# Altium project 175-00029, rev4, 486 CCD Interface.PrjPcb
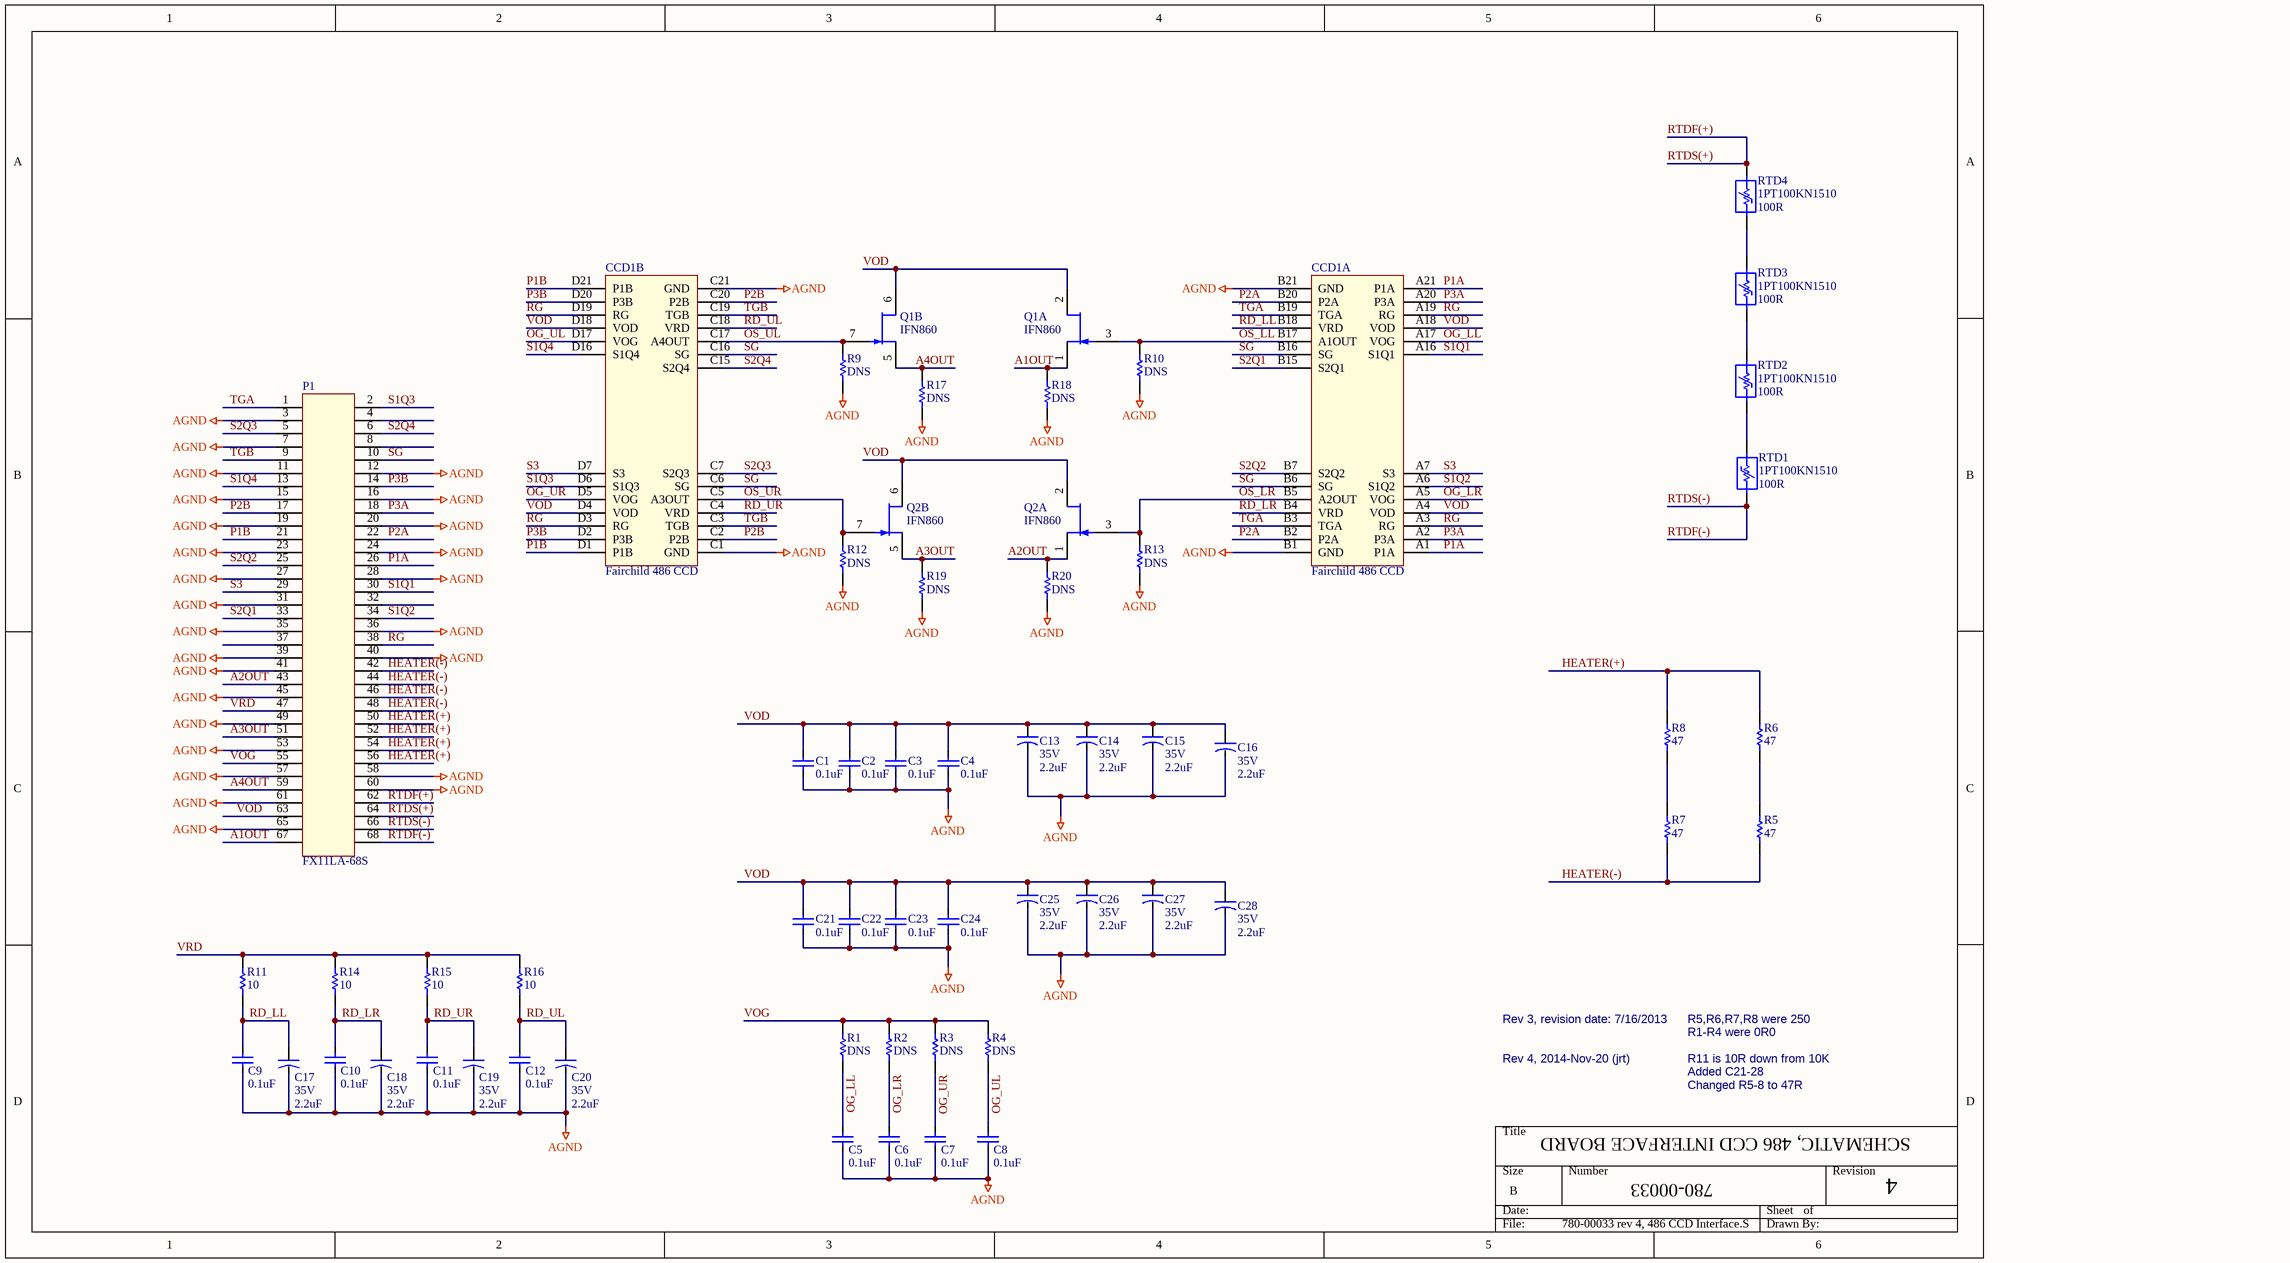
[diagram p0: 780-00033 rev 4, 486 CCD Interface.SchDoc]
1 sheet, 56 parts. Net scope: global (net labels, ports and power ports of the same name join across sheets).
Board file: 175-00029 rev4, 486 CCD Interface.PcbDoc

## Sheet 780-00033 rev 4, 486 CCD Interface.SchDoc
size B; PageSetup: Record=PageOptions|CenterHorizontal=True|CenterVertical=True|PrintScale=1.09|XCorrection=1.00|YCorrection=1.00|PrintKind=0|BorderSize=5000000|LeftOffset=0|BottomOffset=0|Orientation=2|PaperLength=4318|PaperWidth=2794|Scale=100|PaperSource=7|PrintQuality=600|MediaType=1|DitherType=10|PaperKind=Ledger|PrintScaleMode=1

### Parts
C1  value 0.1uF  [SMD_0805]  (hidden comment: Cap SMD)
C2  value 0.1uF  [SMD_0805]  (hidden comment: Cap SMD)
C3  value 0.1uF  [SMD_0805]  (hidden comment: Cap SMD)
C4  value 0.1uF  [SMD_0805]  (hidden comment: Cap SMD)
C5  value 0.1uF  [SMD_0805]  (hidden comment: Cap SMD)
C6  value 0.1uF  [SMD_0805]  (hidden comment: Cap SMD)
C7  value 0.1uF  [SMD_0805]  (hidden comment: Cap SMD)
C8  value 0.1uF  [SMD_0805]  (hidden comment: Cap SMD)
C9  value 0.1uF  [SMD_0805]  (hidden comment: Cap SMD)
C10  value 0.1uF  [SMD_0805]  (hidden comment: Cap SMD)
C11  value 0.1uF  [SMD_0805]  (hidden comment: Cap SMD)
C12  value 0.1uF  [SMD_0805]  (hidden comment: Cap SMD)
C13  35V  value 2.2uF  [SMD_CAP_3216]
C14  35V  value 2.2uF  [SMD_CAP_3216]
C15  35V  value 2.2uF  [SMD_CAP_3216]
C16  35V  value 2.2uF  [SMD_CAP_3216]
C17  35V  value 2.2uF  [SMD_CAP_3216]
C18  35V  value 2.2uF  [SMD_CAP_3216]
C19  35V  value 2.2uF  [SMD_CAP_3216]
C20  35V  value 2.2uF  [SMD_CAP_3216]
C21  value 0.1uF  [SMD_0805]
C22  value 0.1uF  [SMD_0805]
C23  value 0.1uF  [SMD_0805]  (hidden comment: Cap SMD)
C24  value 0.1uF  [SMD_0805]  (hidden comment: Cap SMD)
C25  35V  value 2.2uF  [SMD_CAP_3216]
C26  35V  value 2.2uF  [SMD_CAP_3216]
C27  35V  value 2.2uF  [SMD_CAP_3216]
C28  35V  value 2.2uF  [SMD_CAP_3216]
CCD1  Fairchild 486 CCD  [Fairchild 486]  (parts A,B of 2)
P1  FX11LA-68S
Q1  IFN860  [TO-71]  (parts A,B of 2)
Q2  IFN860  [TO-71]  (parts A,B of 2)
R1  value DNS  [SMD_0805]  (hidden comment: Res SMD)
R2  value DNS  [SMD_0805]  (hidden comment: Res SMD)
R3  value DNS  [SMD_0805]  (hidden comment: Res SMD)
R4  value DNS  [SMD_0805]  (hidden comment: Res SMD)
R5  value 47  [AXIAL-0.5]  (hidden comment: Res TH)
R6  value 47  [AXIAL-0.5]  (hidden comment: Res TH)
R7  value 47  [AXIAL-0.5]  (hidden comment: Res TH)
R8  value 47  [AXIAL-0.5]  (hidden comment: Res TH)
R9  value DNS  [SMD_0805]  (hidden comment: Res SMD)
R10  value DNS  [SMD_0805]  (hidden comment: Res SMD)
R11  value 10  [SMD_0805]  (hidden comment: Res SMD)
R12  value DNS  [SMD_0805]  (hidden comment: Res SMD)
R13  value DNS  [SMD_0805]  (hidden comment: Res SMD)
R14  value 10  [SMD_0805]  (hidden comment: Res SMD)
R15  value 10  [SMD_0805]  (hidden comment: Res SMD)
R16  value 10  [SMD_0805]  (hidden comment: Res SMD)
R17  value DNS  [SMD_0805]  (hidden comment: Res SMD)
R18  value DNS  [SMD_0805]  (hidden comment: Res SMD)
R19  value DNS  [SMD_0805]  (hidden comment: Res SMD)
R20  value DNS  [SMD_0805]  (hidden comment: Res SMD)
RTD1  value 100R  Manuf p/n: 1PT100KN1510  [RTD 1x15mm]  (hidden comment: RTD 2-wire, 1x15mm)
RTD2  value 100R  Manuf p/n: 1PT100KN1510  [RTD 1x15mm]  (hidden comment: RTD 2-wire, 1x15mm)
RTD3  value 100R  Manuf p/n: 1PT100KN1510  [RTD 1x15mm]  (hidden comment: RTD 2-wire, 1x15mm)
RTD4  value 100R  Manuf p/n: 1PT100KN1510  [RTD 1x15mm]  (hidden comment: RTD 2-wire, 1x15mm)

### Nets
AGND: C1.1 C2.1 C3.1 C4.1 C5.1 C6.1 C7.1 C8.1 C9.1 C10.1 C11.1 C12.1 C13.2 C14.2 C15.2 C16.2 C17.2 C18.2 C19.2 C20.2 C21.1 C22.1 C23.1 C24.1 C25.2 C26.2 C27.2 C28.2 CCD1.B1(GND) CCD1.B21(GND) CCD1.C1(GND) CCD1.C21(GND) P1.3 P1.7 P1.11 P1.12 P1.15 P1.16 P1.19 P1.20 P1.23 P1.24 P1.27 P1.28 P1.31 P1.35 P1.36 P1.39 P1.40 P1.41 P1.45 P1.49 P1.53 P1.57 P1.58 P1.60 P1.61 P1.65 R9.1 R10.1 R12.1 R13.1 R17.2 R18.2 R19.2 R20.2
A1OUT: P1.67 Q1.1(S) R18.1
A2OUT: P1.43 Q2.1(S) R20.1
A3OUT: P1.51 Q2.5(S) R19.1
A4OUT: P1.59 Q1.5(S) R17.1
HEATER(+): P1.50 P1.52 P1.54 P1.56 R6.1 R8.2
HEATER(-): P1.42 P1.44 P1.46 P1.48 R5.1 R7.2
OG_LL: C5.2 CCD1.A17(VOG) R1.1
OG_LR: C6.2 CCD1.A5(VOG) R2.1
OG_UL: C8.2 CCD1.D17(VOG) R4.1
OG_UR: C7.2 CCD1.D5(VOG) R3.1
OS_LL: CCD1.B17(A1OUT) Q1.3(G) R10.2
OS_LR: CCD1.B5(A2OUT) Q2.3(G) R13.2
OS_UL: CCD1.C17(A4OUT) Q1.7(G) R9.2
OS_UR: CCD1.C5(A3OUT) Q2.7(G) R12.2
P1A: CCD1.A1(P1A) CCD1.A21(P1A) P1.26
P1B: CCD1.D1(P1B) CCD1.D21(P1B) P1.21
P2A: CCD1.B2(P2A) CCD1.B20(P2A) P1.22
P2B: CCD1.C2(P2B) CCD1.C20(P2B) P1.17
P3A: CCD1.A2(P3A) CCD1.A20(P3A) P1.18
P3B: CCD1.D2(P3B) CCD1.D20(P3B) P1.14
RD_LL: C9.2 C17.1 CCD1.B18(VRD) R11.2
RD_LR: C10.2 C18.1 CCD1.B4(VRD) R14.2
RD_UL: C12.2 C20.1 CCD1.C18(VRD) R16.2
RD_UR: C11.2 C19.1 CCD1.C4(VRD) R15.2
RG: CCD1.A3(RG) CCD1.A19(RG) CCD1.D3(RG) CCD1.D19(RG) P1.38
RTDF(+): P1.62 P1.64 RTD4.2  [also labelled RTDS(+)]
RTDF(-): P1.66 P1.68 RTD1.2  [also labelled RTDS(-)]
S1Q1: CCD1.A16(S1Q1) P1.30
S1Q2: CCD1.A6(S1Q2) P1.34
S1Q3: CCD1.D6(S1Q3) P1.2
S1Q4: CCD1.D16(S1Q4) P1.13
S2Q1: CCD1.B15(S2Q1) P1.33
S2Q2: CCD1.B7(S2Q2) P1.25
S2Q3: CCD1.C7(S2Q3) P1.5
S2Q4: CCD1.C15(S2Q4) P1.6
S3: CCD1.A7(S3) CCD1.D7(S3) P1.29
SG: CCD1.B6(SG) CCD1.B16(SG) CCD1.C6(SG) CCD1.C16(SG) P1.10
TGA: CCD1.B3(TGA) CCD1.B19(TGA) P1.1
TGB: CCD1.C3(TGB) CCD1.C19(TGB) P1.9
VOD: C1.2 C2.2 C3.2 C4.2 C13.1 C14.1 C15.1 C16.1 C21.2 C22.2 C23.2 C24.2 C25.1 C26.1 C27.1 C28.1 CCD1.A4(VOD) CCD1.A18(VOD) CCD1.D4(VOD) CCD1.D18(VOD) P1.63 Q1.2(D) Q1.6(D) Q2.2(D) Q2.6(D)
VOG: P1.55 R1.2 R2.2 R3.2 R4.2
VRD: P1.47 R11.1 R14.1 R15.1 R16.1
NetR5_2: R5.2 R6.2
NetR7_1: R7.1 R8.1
NetRTD1_1: RTD1.1 RTD2.1
NetRTD2_2: RTD2.2 RTD3.1
NetRTD3_2: RTD3.2 RTD4.1

Not connected (* = marked no-connect by the designer): P1 4 8 32 37

### Notes on the sheet
- Rev 3, revision date: 7/16/2013
- R5,R6,R7,R8 were 250
- Rev 4, 2014-Nov-20 (jrt)
- R1-R4 were 0R0
- R11 is 10R down from 10K
- Added C21-28
- Changed R5-8 to 47R
- SCHEMATIC, 486 CCD INTERFACE BOARD
- 780-00033
- 4

### Library data of the parts
C1-C12 C21-C24 = Cap SMD: Capacitor; Manufacturer: AVX; Manuf p/n: 08055C104KAT2A; Vendor: DigiKey; Vendor p/n: 478-1395-1-ND; Vendor Mult.: 10; LCO p/n: 120-00002; COST: 0.088
C13-C20 C25-C28 = Cap 2.2uF 35V Low ESR: outline 3.2mm x 1.6 mm, 1206; Manufacturer: AVX; Manuf p/n: TPSA225K035R1500; Vendor: DigiKey; Vendor p/n: 478-3105-1-ND; Vendor Mult.: 1; LCO p/n: 120-00065; COST: 0.90
P1 = FX11LA-68S: HIROSE 68P Receptacle; Manuf p/n: FX11LA-68S-SV(21); VALUE: 68pin Recepacle; Vendor: DigiKey; Vendor Mult.: 1; Vendor p/n: H2541CT-ND; LCO p/n: 125-00100; COST: 4.03; Manufacturer: HiRose
Q1 Q2 = IFN860: N-JFET NJ450L Process; Manufacturer: INTERFET; Vendor Mult.: 1; LCO p/n: 195-00005; Manuf p/n: IFN860; Vendor: INTERFET; Vendor p/n: IFN860; COST: 12.00; VALUE: IFN860
R1-R4 R9-R20 = Res SMD: Resistor 0805; LCO p/n: 160-00022
R5-R8 = Res TH: Resistor; Manufacturer: Vishay/Dale; Vendor: DigiKey; Vendor Mult.: 1; LCO p/n: 180-00006; COST: 1.21
RTD1-RTD4 = RTD 2-wire, 1x15mm: Pt RTD; Manufacturer: OMEGA; Vendor Mult.: 1; LCO p/n: 135-00003; COST: 13.00; Vendor: OMEGA; Vendor p/n: 1PT100KN1510